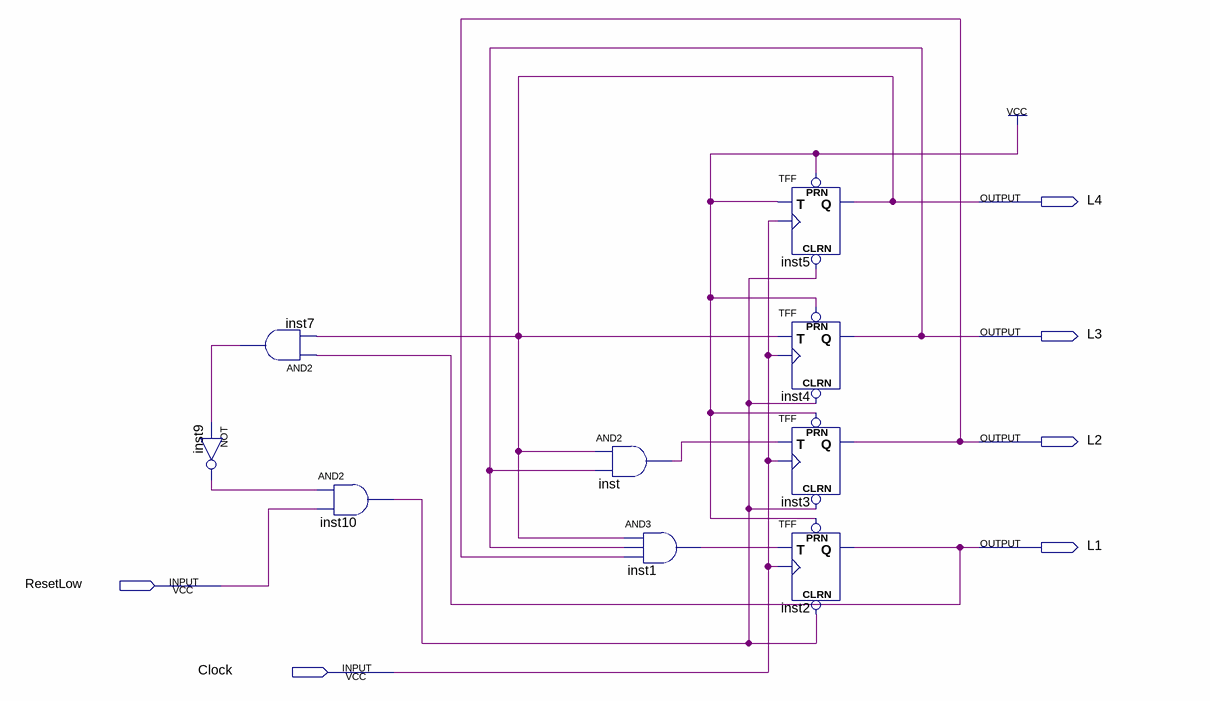
[diagram p0: schematic sheet]
// Quartus schematic Lab3.bdf as structural Verilog: 9 symbols, 6 pins
module Lab3 (
  input  ResetLow,
  input  Clock,
  output L4,
  output L3,
  output L2,
  output L1
);

  wire inst1_out, inst7_out, inst9_out, inst10_out, inst_out;

  and inst7 (inst7_out, L1, L4);
  not inst9 (inst9_out, inst7_out);
  and inst10 (inst10_out, inst9_out, ResetLow);
  and inst (inst_out, L4, L3);
  and inst1 (inst1_out, L4, L3, L2);
  TFF inst5 (.PRN(1'b1), .CLRN(inst10_out), .T(1'b1), .CLK(Clock), .Q(L4));
  TFF inst4 (.PRN(1'b1), .CLRN(inst10_out), .T(L4), .CLK(Clock), .Q(L3));
  TFF inst3 (.PRN(1'b1), .CLRN(inst10_out), .T(inst_out), .CLK(Clock), .Q(L2));
  TFF inst2 (.PRN(1'b1), .CLRN(inst10_out), .T(inst1_out), .CLK(Clock), .Q(L1));
endmodule
